# Altium schematic sheet MB1296-STLINK.SchDoc: STLINK/V2-1
size A4; Date: 25-JAN-2017; DocumentNumber: MB1296; Revision: D-01; SheetNumber: 3; SheetTotal: 6; Project: STM32 LoRa Discovery
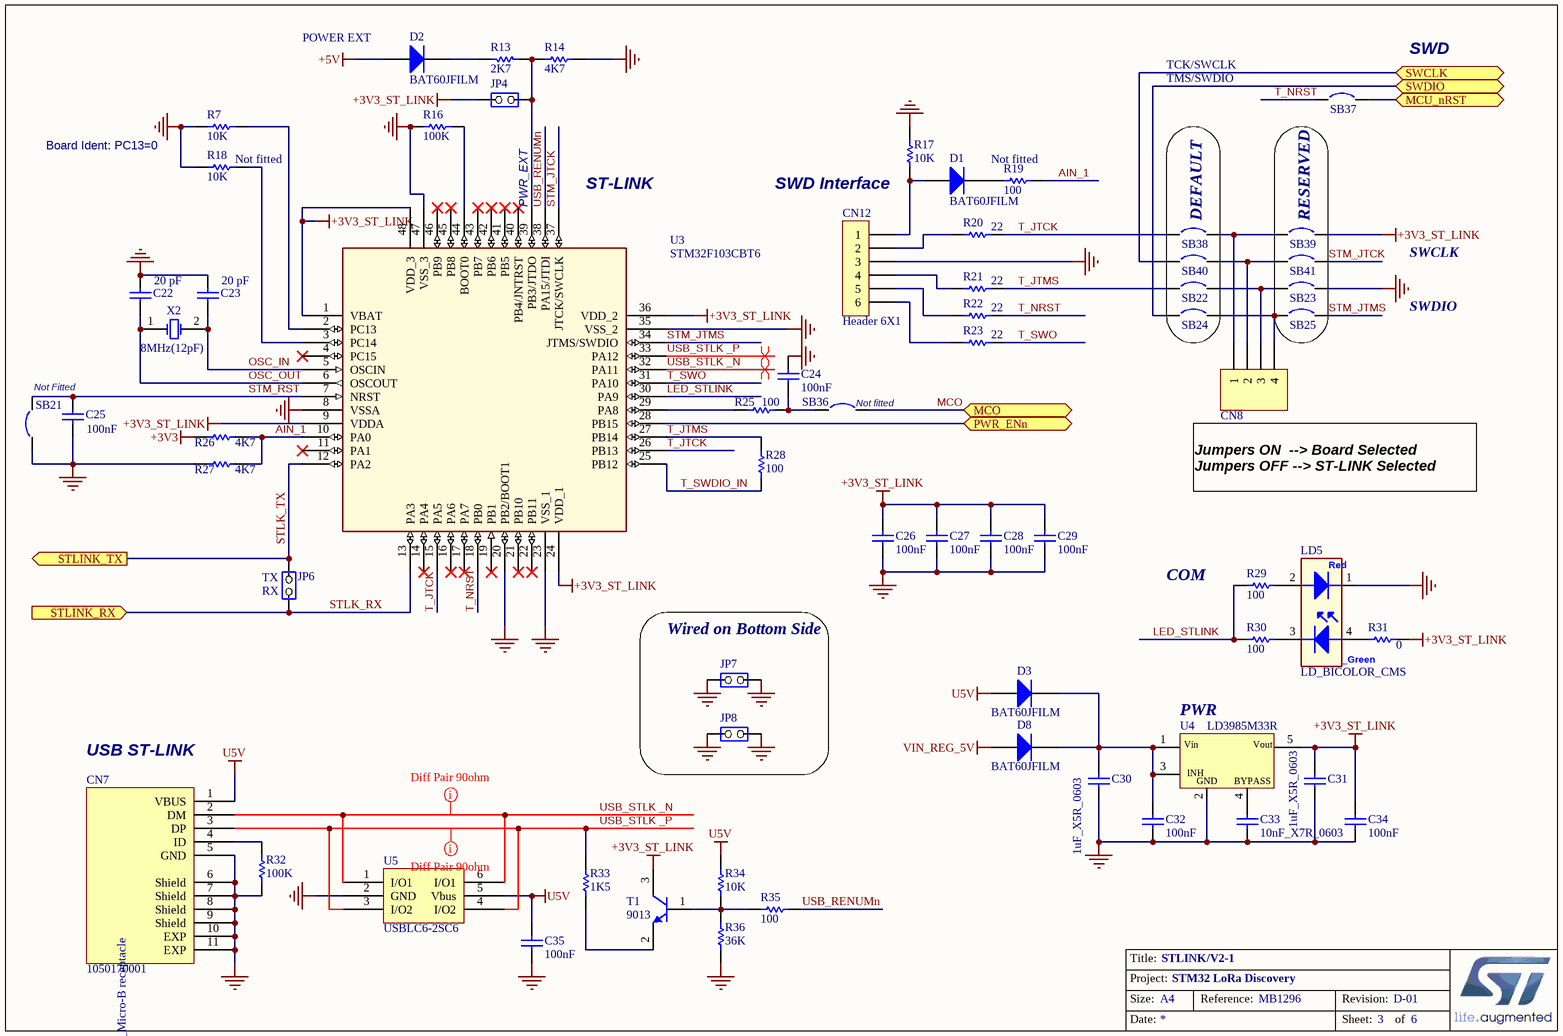
[diagram p0: MB1296-STLINK.SchDoc]

## Parts
C22  20 pF  [0603C]
C23  20 pF  [0603C]
C24  100nF  [0603C]
C25  100nF  [0603C]
C26  100nF  [0603C]
C27  100nF  [0603C]
C28  100nF  [0603C]
C29  100nF  [0603C]
C30  1uF_X5R_0603  [0603C]
C31  1uF_X5R_0603  [0603C]
C32  100nF  [0603C]
C33  10nF_X7R_0603  [0603C]
C34  100nF  [0603C]
C35  100nF  [0603C]
CN7  1050170001  [Molex_1050170001]
CN8  Header 4  [SIP4]  (value not drawn)
CN12  Header 6X1  [Header 1x6 Female (Wrapping)]
D1  BAT60JFILM  [SOD323/A]
D2  BAT60JFILM  [SOD323/A]
D3  BAT60JFILM  [SOD323/A]
D8  BAT60JFILM  [SOD323/A]
JP4  (no value)  [SIP2/2.54]
JP6  (no value)  [SIP2/2.54]
JP7  (no value)  [SIP2/2.54-BOT]
JP8  (no value)  [SIP2/2.54-BOT]
LD5  LD_BICOLOR_CMS  [LED SMD HSMF-A201-A00J1]
R7  10K  [0603]
R13  2K7  [0603]
R14  4K7  [0603]
R16  100K  [0603]
R17  10K  [0603]
R18  10K  [0603]
R19  100  [0603]
R20  22  [0603]
R21  22  [0603]
R22  22  [0603]
R23  22  [0603]
R25  100  [0603]
R26  4K7  [0603]
R27  4K7  [0603]
R28  100  [0603]
R29  100  [0603]
R30  100  [0603]
R31  0  [0603]
R32  100K  [0603]
R33  1K5  [0603]
R34  10K  [0603]
R35  100  [0603]
R36  36K  [0603]
SB21  Circuit Breaker  [JP2_SMD]  (value not drawn)
SB22  Circuit Breaker  [JP2_SMD]  (value not drawn)
SB23  Circuit Breaker  [SB-tiny]  (value not drawn)
SB24  Circuit Breaker  [JP2_SMD]  (value not drawn)
SB25  Circuit Breaker  [SB-tiny]  (value not drawn)
SB36  Circuit Breaker  [JP2_SMD]  (value not drawn)
SB37  Circuit Breaker  [JP2_SMD]  (value not drawn)
SB38  Circuit Breaker  [JP2_SMD]  (value not drawn)
SB39  Circuit Breaker  [SB-tiny]  (value not drawn)
SB40  Circuit Breaker  [JP2_SMD]  (value not drawn)
SB41  Circuit Breaker  [SB-tiny]  (value not drawn)
T1  9013  [SOT-23]
U3  STM32F103CBT6  [QFP48 7X7]
U4  LD3985M33R  [SOT-23-5L]
U5  USBLC6-2SC6  [SOT23-6L]
X2  8MHz(12pF)  [CRY_NX3225GD_2P]

## Blocks framed on the sheet
DEFAULT: SB22 SB24 SB38 SB40
RESERVED: SB23 SB25 SB39 SB41
Wired on Bottom Side: JP7 JP8

## Ports
MCO, MCU_nRST, PWR_ENn (bidir), STLINK_RX (in), STLINK_TX (out), SWCLK, SWDIO

## Nets
+3V3: R26.1
+3V3_ST_LINK: C26.2 C27.2 C28.2 C29.2 C31.2 C34.2 JP4.1(COMMON) R31.2 SB39.2 T1.3(C) U3.1(VBAT) U3.9(VDDA) U3.24(VDD_1) U3.36(VDD_2) U3.48(VDD_3) U4.5(Vout)
+5V: D2.1(A)
GND: C22.2 C23.2 C24.2 C25.1 C26.1 C27.1 C28.1 C29.1 C30.1 C31.1 C32.1 C33.1 C34.1 C35.1 CN7.5(GND) CN7.6(Shield) CN7.7(Shield) CN7.8(Shield) CN7.9(Shield) CN7.10(EXP) CN7.11(EXP) CN12.3 JP7.1(COMMON) JP7.2(NO) JP8.1(COMMON) JP8.2(NO) LD5.1 R7.2 R14.2 R16.2 R17.1 R18.2 R27.1 R32.1 R36.1 SB21.1 SB23.2 U3.8(VSSA) U3.20(PB2/BOOT1) U3.23(VSS_1) U3.35(VSS_2) U3.47(VSS_3) U4.2(GND) U5.2(GND)
U5V: C35.2 CN7.1(VBUS) D3.1(A) R34.1 U5.5(Vbus)
VIN_REG_5V: D8.1(A)
AIN_1: R19.1 R26.2 R27.2 U3.10(PA0)
LED_STLINK: R29.2 R30.2 U3.30(PA9)
MCO: SB36.2 ; port MCO
MCU_nRST: SB37.2 ; port MCU_nRST
OSC_IN: C23.1 U3.5(OSCIN) X2.2(OSC2)
OSC_OUT: C22.1 U3.6(OSCOUT) X2.1(OSC1)
PWR_ENn: U3.28(PB15) ; port PWR_ENn
STLK_RX: JP6.1(COMMON) U3.13(PA3) ; port STLINK_RX
STLK_TX: JP6.2(NO) U3.12(PA2) ; port STLINK_TX
STM_JTCK: SB41.2 U3.37(JTCK/SWCLK)
STM_JTMS: SB25.2 U3.34(JTMS/SWDIO)
STM_RST: C25.2 SB21.2 U3.7(NRST)
SWCLK: SB40.1 ; port SWCLK
SWDIO: SB24.1 ; port SWDIO
T_JTCK: R20.1 SB38.1 U3.15(PA5) U3.26(PB13)
T_JTMS: R21.1 R28.2 SB22.1 U3.27(PB14)
T_NRST: R22.1 SB37.1 U3.18(PB0)
T_SWDIO_IN: R28.1 U3.25(PB12)
T_SWO: R23.1 U3.31(PA10)
USB_RENUMn: R35.1 U3.38(PA15/JTDI)
USB_STLK _N: CN7.2(DM) U3.32(PA11) U5.1(I/O1) U5.6(I/O1)
USB_STLK _P: CN7.3(DP) R33.2 U3.33(PA12) U5.3(I/O2) U5.4(I/O2)
NetC24_1: C24.1 R25.1 SB36.1
NetC30_2: C30.2 C32.2 D3.2(K) D8.2(K) U4.1(Vin) U4.3(CE)
NetC33_2: C33.2 U4.4(BYPASS)
NetCN7_4: CN7.4(ID) R32.2
NetCN8_1: CN8.1 SB38.2 SB39.1
NetCN8_2: CN8.2 SB40.2 SB41.1
NetCN8_3: CN8.3 SB22.2 SB23.1
NetCN8_4: CN8.4 SB24.2 SB25.1
NetCN12_1: CN12.1 D1.1(A) R17.2
NetCN12_2: CN12.2 R20.2
NetCN12_4: CN12.4 R21.2
NetCN12_5: CN12.5 R22.2
NetCN12_6: CN12.6 R23.2
NetD1_2: D1.2(K) R19.2
NetD2_2: D2.2(K) R13.1
NetJP4_2: JP4.2(NO) R13.2 R14.1 U3.39(PB3/JTDO)
NetLD5_2: LD5.2 R29.1
NetLD5_3: LD5.3 R30.1
NetLD5_4: LD5.4 R31.1
NetR7_1: R7.1 U3.2(PC13)
NetR16_1: R16.1 U3.44(BOOT0)
NetR18_1: R18.1 U3.3(PC14)
NetR25_2: R25.2 U3.29(PA8)
NetR33_1: R33.1 T1.2(E)
NetR34_2: R34.2 R35.2 R36.2 T1.1(B)

Not connected (* = marked no-connect by the designer): U3 4(PC15)* 11(PA1)* 14(PA4)* 16(PA6)* 17(PA7)* 19(PB1)* 21(PB10)* 22(PB11)* 40(PB4/JNTRST)* 41(PB5)* 42(PB6)* 43(PB7)* 45(PB8)* 46(PB9)*

## Layout directives
differential pair: USB_STLK _N, USB_STLK _P
mark named Diff Pair 90ohm: USB_STLK _N, USB_STLK _P

## Notes on the sheet
- POWER EXT
- TCK/SWCLK
- TMS/SWDIO
- SWD
- Board Ident: PC13=0
- (near R18) Not fitted
- (near R19) Not fitted
- (near U3) PWR_EXT
- ST-LINK
- SWD Interface
- SWCLK
- SWDIO
- Not Fitted
- (near SB36) Not fitted
- Jumpers ON  --> Board Selected
  Jumpers OFF --> ST-LINK Selected
- (near JP6) TX
- COM
- (near JP6) RX
- (near U4) PWR
- (near CN7) USB ST-LINK
- Title:
- Project:
- Size:
- Date:
- A4
- Reference:
- Sheet:
- Revision:
- of
- (in symbol 1050170001) USB_Micro-B receptacle
- (in symbol LD3985M33R) INH
- (in symbol LD_BICOLOR_CMS) Red; _Green

## Library data of the parts
C22 C23 = Capacitor_ST: Capacitor 0603; Manufacturer: YAGEO; Manufacturer P/N: CC0603JRNPO9BN200; Value: 20pF; Provided by: Subcon; Revision: July-2002: Re-released for DXP Platform.; ECCN_US/UE: *; Fitted: *; Order Code Digikey: *; Order Code Farnell: *; Order Code RS: *
C24-C29 C32 C34 C35 = CAP: Capacitor 100nF; Manufacturer: YAGEO; Manufacturer P/N: CC0603KRX7R9BB104; Provided by: Subcon; Revision: July-2002: Re-released for DXP Platform.; Value: 100nF; ECCN_US/UE: *; Fitted: *; Order Code Digikey: *; Order Code Farnell: *; Order Code RS: *
C30 C31 = CAP SMD 0603  X5R 1µF 25V 10%: 0603  X5R 1µF; Manufacturer: YAGEO; Manufacturer P/N: CC0603KRX5R7BB105; Provided by: Subcon; Order code Farnell: 1288202RL; Value: 1µF; ECCN_US/UE: *; Fitted: *; Order Code Digikey: *
C33 = CAP SMD 0603  X7R 10000PF 50V 10%: 0603  X7R 10NF; Manufacturer: YAGEO; Manufacturer P/N: CC0603KRX7R9BB103; Order code RS: 2040779; Provided by: Subcon; Order code Farnell: 7569548RL; Value: 10NF; ECCN_US/UE: *; Fitted: *; Order Code Digikey: *
CN7 = 1050170001: Silkscreen: USB
CN8 = Header 4: Header, 4-Pin, Single row; Manufacturer: Lyconn; Manufacturer P/N: 313140S111116; Provided by: Subcon; Revision: 17-Jul-2002: Re-released for DXP Platform.; ECCN_US/UE: *; Fitted: *; Order Code Digikey: *; Order Code Farnell: *; Order Code RS: *; Value: *
CN12 = Header 6X1: Header, 6-Pin, Single row; Manufacturer: Lyconn; Manufacturer P/N: 218106S1610; Provided by: Subcon; ECCN_US/UE: *; Fitted: *; Order Code Digikey: *; Order Code Farnell: *; Order Code RS: *; Value: *
D1-D3 D8 = BAT60JFILM: Manufacturer: STM; ECCN_US/EU: EAR99/NEC; Provided by: ST; Manufacturer P/N: BAT60JFILM; Fitted: *
JP4 JP6-JP8 = JP2: Manufacturer: Lyconn; Manufacturer P/N: 313140S111116; Provided by: Subcon; ECCN_US/UE: *; Fitted: *; Order Code Digikey: *; Order Code Farnell: *; Order Code RS: *; Value: *
LD5 = LD_BICOLOR_CMS: Bicolor Led; Manufacturer: everluck-led; Manufacturer P/N: LE-RGW35280; Provided by: Subcon; ECCN_US/UE: *; Fitted: *; Order Code Digikey: *; Order Code Farnell: *; Order Code RS: *; Value: *
R7 R17 R34 = Resistor_ST: Resistor 0603; Manufacturer: YAGEO; Manufacturer P/N: RC0603JR-0710KL; Provided by: Subcon; Value: 10K; ECCN_US/UE: *; Fitted: *; Order Code Digikey: *; Order Code Farnell: *; Order Code RS: *
R13 R36 = Res1: Resistor; Value: 1K; Published: 8-Jun-2000; Revision: July-2002: Re-released for DXP Platform.; Publisher: Altium Limited
R14 R26 R27 = res1_4: Resistor; Manufacturer: YAGEO; Manufacturer P/N: RC0603FR-074K7L; Provided by: Subcon; Revision: July-2002: Re-released for DXP Platform.; ECCN_US/UE: *; Fitted: *; Order Code Digikey: *; Order Code Farnell: *; Order Code RS: *; Value: 4K7
R16 R32 = RES SMD 0603 100K 75V 5% 0.1W: 0603 100K 75V 5% 0.1W; Manufacturer: YAGEO; Manufacturer P/N: RC0603FR-07100KL; Provided by: Subcon; Order code Farnell: 1692517; Value: 100K; ECCN_US/UE: *; Fitted: *; Order Code Digikey: *
R18 = Resistor_ST: Resistor 0603; Manufacturer: YAGEO; Manufacturer P/N: RC0603JR-0710KL; Fitted: No; Provided by: Subcon; Value: 10K; ECCN_US/UE: *; Order Code Digikey: *; Order Code Farnell: *; Order Code RS: *
R19 = Res1_1: Resistor 0603; Manufacturer: YAGEO; Manufacturer P/N: RC0603FR-07100RL; Fitted: No; Provided by: Subcon; Value: 100R; ECCN_US/UE: *; Order Code Digikey: *; Order Code Farnell: *; Order Code RS: *
R20-R23 = Res1_1: Resistor 0603; Manufacturer: YAGEO; Manufacturer P/N: RC0603FR-0722RL; Provided by: Subcon; Value: 100R; ECCN_US/UE: *; Fitted: *; Order Code Digikey: *; Order Code Farnell: *; Order Code RS: *
R25 R28-R30 R35 = Res1_1: Resistor 0603; Manufacturer: YAGEO; Manufacturer P/N: RC0603FR-07100RL; Provided by: Subcon; Value: 100R; ECCN_US/UE: *; Fitted: *; Order Code Digikey: *; Order Code Farnell: *; Order Code RS: *
R31 = Resistor_ST: Resistor 0402 / 0603 / 0805; Value: 10K
R33 = RES SMD 0603 100K 75V 5% 0.1W: 0603 1K5 75V 5% 0.1W; Manufacturer: YAGEO; Manufacturer P/N: RC0603FR-071K5L; Provided by: Subcon; Value: 1K5; ECCN_US/UE: *; Fitted: *; Order Code Digikey: *
SB21 SB23 SB25 SB36 SB39 SB41 = Circuit Breaker: Fitted: No; Revision: July-2002: Re-released for DXP Platform.; ECCN_US/UE: *; Manufacturer: *; Manufacturer P/N: *; Order Code Digikey: *; Order Code Farnell: *; Order Code RS: *; Provided by: *; Value: *
SB22 SB24 SB37 SB38 SB40 = Circuit Breaker: Fitted: Yes; Revision: July-2002: Re-released for DXP Platform.; ECCN_US/UE: *; Manufacturer: *; Manufacturer P/N: *; Order Code Digikey: *; Order Code Farnell: *; Order Code RS: *; Provided by: *; Value: *
T1 = NPN: NPN Bipolar Transistor; Manufacturer: STMicroelectronics; Manufacturer P/N: MMBT9013; ECCN_US/UE: EAR99/NEC; Provided by: STM; Revision: July-2002: Re-released for DXP Platform.; Fitted: *; Order Code Digikey: *; Order Code Farnell: *; Order Code RS: *; Value: *
U3 = STM32F103CBT6: Medium-density performance line ARM-based 32-bit MCU with 64KB Flash; Manufacturer P/N: STM32F103C8T6; Manufacturer: STM; Ref STM: 9175981; Provided by: ST; ECCN_US/EU: 3A991A2/NEC; Order: STM32F103C8T6; Fitted: *; Order Code Digikey: *; Order Code Farnell: *; Order Code RS: *; Value: *
U4 = LD3985M33R: Ultra low drop-low noise BiCMOS voltage, regulators low ESR capacitors compatible; Manufacturer: STM; Ref St: 9176161; ECCN_US/EU: EAR99/NEC; Manufacturer P/N: LD3985M33R; Provided by: STM; Fitted: *; Order Code Farnell: *; Order Code RS: *
U5 = USBLC6-2SC6: Manufacturer: STMicroelectronics; Manufacturer P/N: USBLC6-4SC6; ECCN_US/UE: EAR99/NEC; Provided by: STM; Fitted: *; Order Code Digikey: *; Order Code Farnell: *; Order Code RS: *; Value: *
X2 = XTAL: Crystal Oscillator; Manufacturer: HongKongCrystal; Manufacturer P/N: 9SL8000012AFXHF0-SJ28; Provided by: Subcon; ECCN_US/UE: *; Fitted: *; Order Code Digikey: *; Order Code Farnell: *; Order Code RS: *; Value: 8MHz